# Altium schematic sheet power_supply_and_battery_management.schdoc: Power Supply
size A4; Author: John-William Lebel; DocumentNumber: 1; Revision: A; SheetNumber: 1; SheetTotal: 4
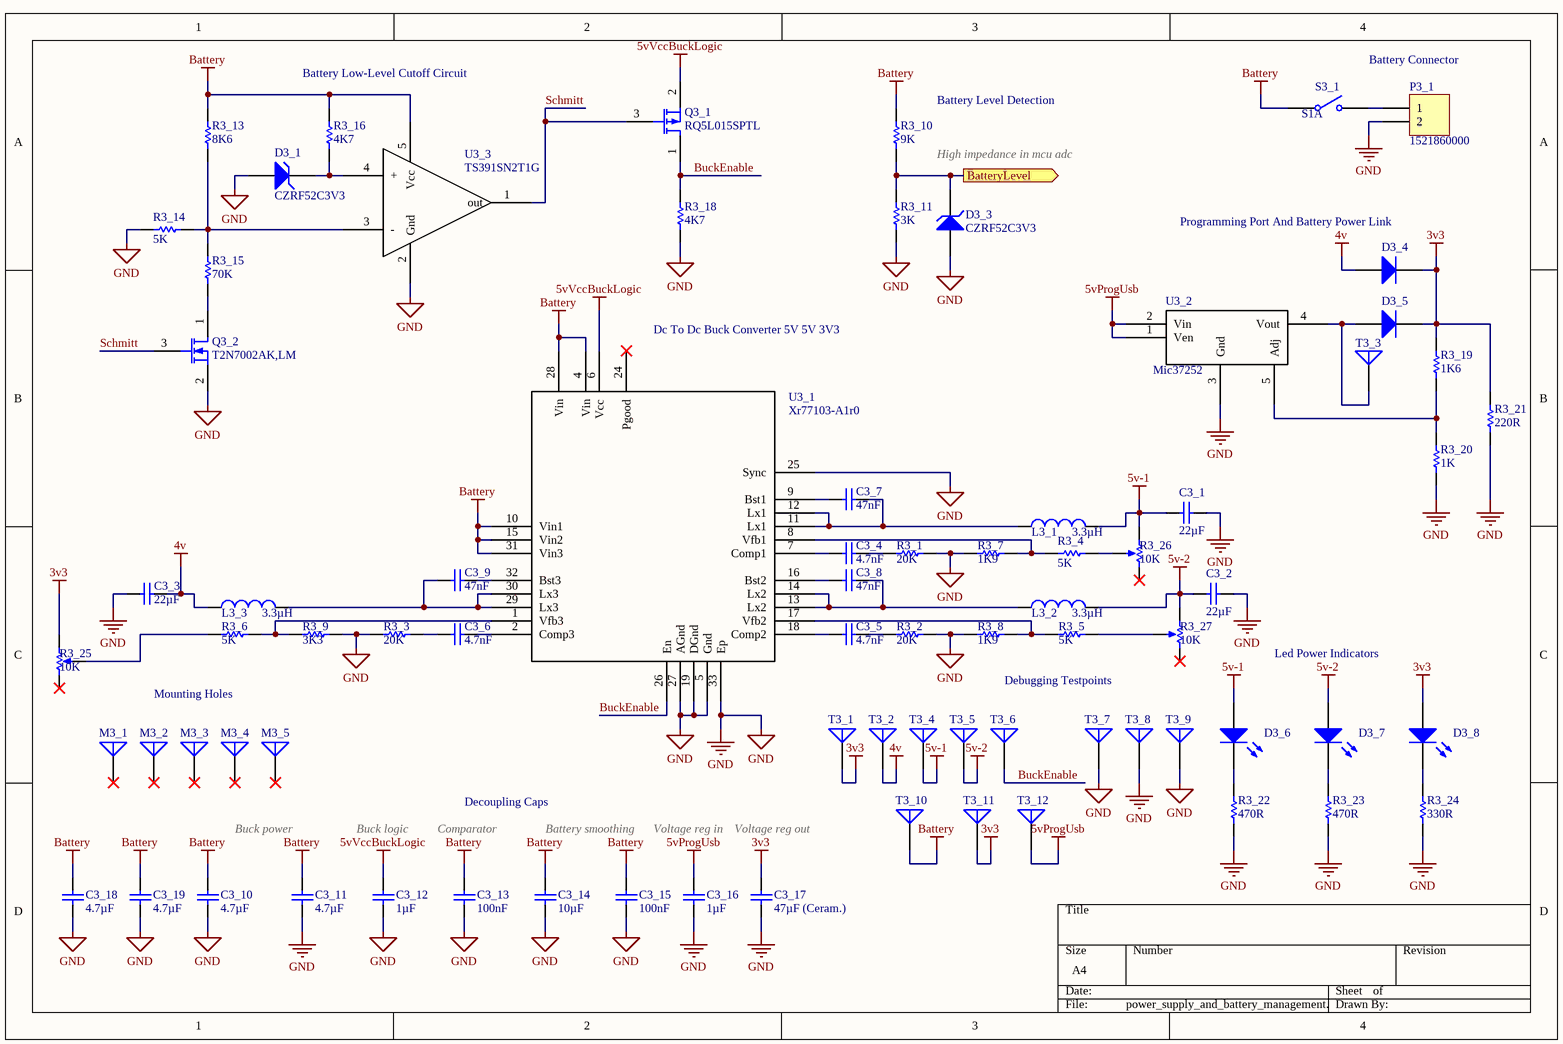
[diagram p0: power_supply_and_battery_management.schdoc]

## Parts
C3_1  value 22µF  [C1206]  (hidden comment: CL31A226KOHNNNE)
C3_2  value 22µF  [C1206]  (hidden comment: CL31A226KOHNNNE)
C3_3  value 22µF  [C1206]  (hidden comment: CL31A226KOHNNNE)
C3_4  value 4.7nF  [C1206]  (hidden comment: CML1206X7R472KT50V)
C3_5  value 4.7nF  [C1206]  (hidden comment: CML1206X7R472KT50V)
C3_6  value 4.7nF  [C1206]  (hidden comment: CML1206X7R472KT50V)
C3_7  value 47nF  [C1206]  (hidden comment: 885012208085)
C3_8  value 47nF  [C1206]  (hidden comment: 885012208085)
C3_9  value 47nF  [C1206]  (hidden comment: 885012208085)
C3_10  value 4.7µF  [C1206]  (hidden comment: CM316X5R475K25AT)
C3_11  value 4.7µF  [C1206]  (hidden comment: CM316X5R475K25AT)
C3_12  value 1µF  [C1206]  (hidden comment: 885382208005)
C3_13  value 100nF  [C1206]  (hidden comment: 12063C104MAT2A)
C3_14  value 10µF  [C1206]  (hidden comment: EMK316BJ106MLHT)
C3_15  value 100nF  [C1206]  (hidden comment: 12063C104MAT2A)
C3_16  value 1µF  [C1206]  (hidden comment: 885382208005)
C3_17  value 47µF (Ceram.)  [C1206]  (hidden comment: EMK316BBJ476ML-T)
C3_18  value 4.7µF  [C1206]  (hidden comment: CM316X5R475K25AT)
C3_19  value 4.7µF  [C1206]  (hidden comment: CM316X5R475K25AT)
D3_1  CZRF52C3V3  [C1206-POLARIZED]
D3_3  CZRF52C3V3  [C1206-POLARIZED]
D3_4  ACDBN160-HF  [C1206-POLARIZED]  (value not drawn)
D3_5  ACDBN160-HF  [C1206-POLARIZED]  (value not drawn)
D3_6  APT3216SGC  [C1206-POLARIZED]  (value not drawn)
D3_7  APT3216SGC  [C1206-POLARIZED]  (value not drawn)
D3_8  APT3216SGC  [C1206-POLARIZED]  (value not drawn)
L3_1  value 3.3µH  [mpxv1D0830]  (hidden comment: MPXV1D0830L3R3)
L3_2  value 3.3µH  [mpxv1D0830]  (hidden comment: MPXV1D0830L3R3)
L3_3  value 3.3µH  [mpxv1D0830]  (hidden comment: MPXV1D0830L3R3)
M3_1  Mounting Hole  [MOUNTING-HOLE-M3]  (value not drawn)
M3_2  Mounting Hole  [MOUNTING-HOLE-M3]  (value not drawn)
M3_3  Mounting Hole  [MOUNTING-HOLE-M3]  (value not drawn)
M3_4  Mounting Hole  [MOUNTING-HOLE-M3]  (value not drawn)
M3_5  Mounting Hole  [MOUNTING-HOLE-M3]  (value not drawn)
P3_1  1521860000  [HDR1X2-508-POLARIZED]
Q3_1  RQ5L015SPTL  [SOT23_L]
Q3_2  T2N7002AK,LM  [SOT23_L]
R3_1  value 20K  [C1206]  (hidden comment: Res1)
R3_2  value 20K  [C1206]  (hidden comment: Res1)
R3_3  value 20K  [C1206]  (hidden comment: Res1)
R3_4  value 5K  [C1206]  (hidden comment: Res1)
R3_5  value 5K  [C1206]  (hidden comment: Res1)
R3_6  value 5K  [C1206]  (hidden comment: Res1)
R3_7  value 1K9  [C1206]  (hidden comment: Res1)
R3_8  value 1K9  [C1206]  (hidden comment: Res1)
R3_9  value 3K3  [C1206]  (hidden comment: Res1)
R3_10  value 9K  [C1206]  (hidden comment: Res1)
R3_11  value 3K  [C1206]  (hidden comment: Res1)
R3_13  value 8K6  [C1206]  (hidden comment: Res1)
R3_14  value 5K  [C1206]  (hidden comment: Res1)
R3_15  value 70K  [C1206]  (hidden comment: Res1)
R3_16  value 4K7  [C1206]  (hidden comment: Res1)
R3_18  value 4K7  [C1206]  (hidden comment: Res1)
R3_19  value 1K6  [C1206]  (hidden comment: Res1)
R3_20  value 1K  [C1206]  (hidden comment: Res1)
R3_21  value 220R  [C1206]  (hidden comment: Res1)
R3_22  value 470R  [C1206]  (hidden comment: Res1)
R3_23  value 470R  [C1206]  (hidden comment: Res1)
R3_24  value 330R  [C1206]  (hidden comment: Res1)
R3_25  value 10K  [ST-4ETA103]  (hidden comment: ST4ETA103)
R3_26  value 10K  [ST-4ETA103]  (hidden comment: ST4ETA103)
R3_27  value 10K  [ST-4ETA103]  (hidden comment: ST4ETA103)
S3_1  S1A  [SW2-THR]
T3_1  Mounting Hole  [TESTPOINT]  (value not drawn)
T3_2  Mounting Hole  [TESTPOINT]  (value not drawn)
T3_3  Mounting Hole  [TESTPOINT]  (value not drawn)
T3_4  Mounting Hole  [TESTPOINT]  (value not drawn)
T3_5  Mounting Hole  [TESTPOINT]  (value not drawn)
T3_6  Mounting Hole  [TESTPOINT]  (value not drawn)
T3_7  Mounting Hole  [TESTPOINT]  (value not drawn)
T3_8  Mounting Hole  [TESTPOINT]  (value not drawn)
T3_9  Mounting Hole  [TESTPOINT]  (value not drawn)
T3_10  Mounting Hole  [TESTPOINT]  (value not drawn)
T3_11  Mounting Hole  [TESTPOINT]  (value not drawn)
T3_12  Mounting Hole  [TESTPOINT]  (value not drawn)
U3_1  Xr77103-A1r0  [32-TQFN (4x4)]
U3_2  Mic37252  [TO-263 (5)]
U3_3  TS391SN2T1G  [TSOP5(6)]

## Ports
BatteryLevel (out)

## Nets
3v3: C3_17.2 D3_4.2(K) D3_5.2(K) D3_8.1(A) R3_19.1 R3_21.1 R3_25.1(BOT) T3_1.1(A) T3_11.1(A)
4v: C3_3.2 D3_4.1(A) L3_3.1 T3_2.1(A)
5v-1: C3_1.2 D3_6.1(A) L3_1.2 R3_26.1(TOP) T3_4.1(A)
5v-2: C3_2.2 D3_7.1(A) L3_2.2 R3_27.1(TOP) T3_5.1(A)
5vProgUsb: C3_16.2 T3_12.1(A) U3_2.1(Ven) U3_2.2(Vin)
5vVccBuckLogic: C3_12.2 Q3_1.2(S) U3_1.6(Vcc)
Battery: C3_10.2 C3_11.2 C3_13.2 C3_14.2 C3_15.2 C3_18.2 C3_19.2 R3_10.2 R3_13.2 R3_16.2 S3_1.1(COMMON) T3_10.1(A) U3_1.4(Vin) U3_1.10(Vin1) U3_1.15(Vin2) U3_1.28(Vin) U3_1.31(Vin3) U3_3.5(Vcc)
GND: C3_1.1 C3_2.1 C3_3.1 C3_10.1 C3_11.1 C3_12.1 C3_13.1 C3_14.1 C3_15.1 C3_16.1 C3_17.1 C3_18.1 C3_19.1 D3_1.1(A) D3_3.1(A) P3_1.2 Q3_2.2(S) R3_1.2 R3_2.2 R3_3.1 R3_7.1 R3_8.1 R3_9.2 R3_11.1 R3_14.1 R3_18.1 R3_20.2 R3_21.2 R3_22.2 R3_23.2 R3_24.2 T3_7.1(A) T3_8.1(A) T3_9.1(A) U3_1.5(Gnd) U3_1.19(DGnd) U3_1.25(Sync) U3_1.27(AGnd) U3_1.33(Ep) U3_2.3(Gnd) U3_3.2(Gnd)
BatteryLevel: D3_3.2(K) R3_10.1 R3_11.2 ; port BatteryLevel
BuckEnable: Q3_1.1(D) R3_18.2 T3_6.1(A) U3_1.26(En)
Schmitt: Q3_1.3(G) Q3_2.3(G) U3_3.1(out)
NetC3_4_1: C3_4.1 U3_1.7(Comp1)
NetC3_4_2: C3_4.2 R3_1.1
NetC3_5_1: C3_5.1 U3_1.18(Comp2)
NetC3_5_2: C3_5.2 R3_2.1
NetC3_6_1: C3_6.1 R3_3.2
NetC3_6_2: C3_6.2 U3_1.2(Comp3)
NetC3_7_1: C3_7.1 U3_1.9(Bst1)
NetC3_7_2: C3_7.2 L3_1.1 U3_1.11(Lx1) U3_1.12(Lx1)
NetC3_8_1: C3_8.1 U3_1.16(Bst2)
NetC3_8_2: C3_8.2 L3_2.1 U3_1.13(Lx2) U3_1.14(Lx2)
NetC3_9_1: C3_9.1 L3_3.2 U3_1.29(Lx3) U3_1.30(Lx3)
NetC3_9_2: C3_9.2 U3_1.32(Bst3)
NetD3_1_2: D3_1.2(K) R3_16.1 U3_3.4(+)
NetD3_5_1: D3_5.1(A) T3_3.1(A) U3_2.4(Vout)
NetD3_6_2: D3_6.2(K) R3_22.1
NetD3_7_2: D3_7.2(K) R3_23.1
NetD3_8_2: D3_8.2(K) R3_24.1
NetP3_1_1: P3_1.1 S3_1.2(NO)
NetQ3_2_1: Q3_2.1(D) R3_15.1
NetR3_4_1: R3_4.1 R3_7.2 U3_1.8(Vfb1)
NetR3_4_2: R3_4.2 R3_26.3(TAP)
NetR3_5_1: R3_5.1 R3_8.2 U3_1.17(Vfb2)
NetR3_5_2: R3_5.2 R3_27.3(TAP)
NetR3_6_1: R3_6.1 R3_25.3(TAP)
NetR3_6_2: R3_6.2 R3_9.1 U3_1.1(Vfb3)
NetR3_13_1: R3_13.1 R3_14.2 R3_15.2 U3_3.3(-)
NetR3_19_2: R3_19.2 R3_20.1 U3_2.5(Adj)

Not connected (* = marked no-connect by the designer): M3_1 1(A)*; M3_2 1(A)*; M3_3 1(A)*; M3_4 1(A)*; M3_5 1(A)*; R3_25 2(TOP)*; R3_26 2(BOT)*; R3_27 2(BOT)*; U3_1 24(Pgood)*

## Notes on the sheet
- (near R3_16) Battery Low-Level Cutoff Circuit
- (near R3_10) Battery Level Detection
- Battery Connector
- High impedance in mcu adc
- (near D3_4) Programming Port And Battery Power Link
- Dc To Dc Buck Converter 5V 5V 3V3
- Led Power Indicators
- Mounting Holes
- Debugging Testpoints
- Buck power
- Buck logic
- Comparator
- Decoupling Caps
- Battery smoothing
- Voltage reg in
- Voltage reg out

## Library data of the parts
C3_1-C3_19 = Cap: Capacitor; Published: 8-Jun-2000; LatestRevisionDate: 17-Jul-2002; LatestRevisionNote: Re-released for DXP Platform.; PackageReference: RAD-0.3; Publisher: Altium Limited; PackageDescription: Radial Cap, Thru-Hole; 2 Leads; 0.3 in Pin Spacing
D3_1 D3_3 = D Zener: Zener Diode; Published: 8-Jun-2000; LatestRevisionDate: 17-Jul-2002; LatestRevisionNote: Re-released for DXP Platform.; PackageReference: DIODE-0.7; Publisher: Altium Limited; PackageDescription: Diode, Thru-Hole; 2 Leads; 0.7 in Pin Spacing
D3_4 D3_5 = Diode: Default Diode; Published: 8-Jun-2000; LatestRevisionDate: 17-Jul-2002; LatestRevisionNote: Re-released for DXP Platform.; PackageVersion: Sep-1996; PackageReference: SMC; Publisher: Altium Limited; PackageDescription: DO-214-AB/SMC; 2 C-Bend Leads; Body 7.9 x 5.9 mm, inc. leads (LxW); Code_JEDEC: DO-214-AB
D3_6-D3_8 = LED0: Typical INFRARED GaAs LED; Published: 8-Jun-2000; LatestRevisionDate: 08-Jul-2005; LatestRevisionNote: Mech Layer 1 removed.; PackageReference: LED-0; Publisher: Altium Limited; PackageDescription: LED; 2 Leads
L3_1-L3_3 = Inductor: Code_IEC: 1005; Published: 8-Jun-2000; LatestRevisionDate: 29-May-2009; LatestRevisionNote: IPC-7351 Footprint Added.; PackageReference: 0402-A; Publisher: Altium Limited; PackageDescription: Chip Inductor; Code_JEITA: 0402
M3_1-M3_5 T3_1-T3_12 = Antenna: Generic Antenna; Published: 24-Mar-1999; LatestRevisionDate: 17-Jul-2002; LatestRevisionNote: Re-released for DXP Platform.; PackageReference: PIN1; Publisher: Altium Limited
P3_1 = Header 2: Header, 2-Pin; LatestRevisionDate: 17-Jul-2002; LatestRevisionNote: Re-released for DXP Platform.; Publisher: Altium Limited
Q3_1 = MOSFET-P: P-Channel MOSFET; Published: 8-Jun-2000; LatestRevisionDate: 17-Jul-2002; LatestRevisionNote: Re-released for DXP Platform.; PackageVersion: 1995/1996; PackageReference: E3; Publisher: Altium Limited; PackageDescription: TO, Flat Index; 3 In-Line, Axial Leads; Body Dia. 4.6mm; Lead Dia. 0.5 mm (max)
Q3_2 = MOSFET-N: N-Channel MOSFET; Published: 8-Jun-2000; LatestRevisionDate: 17-Jul-2002; LatestRevisionNote: Re-released for DXP Platform.; PackageVersion: 1995/1996; PackageReference: E3; Publisher: Altium Limited; PackageDescription: TO, Flat Index; 3 In-Line, Axial Leads; Body Dia. 4.6mm; Lead Dia. 0.5 mm (max)
R3_1-R3_11 R3_13-R3_16 R3_18-R3_24 = Res1: Resistor; Published: 8-Jun-2000; LatestRevisionDate: 17-Jul-2002; LatestRevisionNote: Re-released for DXP Platform.; PackageReference: AXIAL-0.3; Publisher: Altium Limited; PackageDescription: Axial Device, Thru-Hole; 2 Leads; 0.3 in Pin Spacing
R3_25-R3_27 = RPot: Potentiometer; Sim Note: Enter the Resistance value and the set point into parameter fields.; Set Position: 0.5; Published: 8-Jun-2000; LatestRevisionDate: 17-Jul-2002; LatestRevisionNote: Re-released for DXP Platform.; PackageReference: VR5; Publisher: Altium Limited; PackageDescription: Variable Resistor, Thru-Hole; 3 Leads
S3_1 = SW-SPST: Single-Pole, Single-Throw Switch; Published: 24-Mar-1999; LatestRevisionDate: 17-Jul-2002; LatestRevisionNote: Re-released for DXP Platform.; PackageReference: SPST-2; Publisher: Altium Limited; PackageDescription: Switch; 2 Leads
U3_1 = Xr77103-A1r0: Dc to dc step down converter
U3_3 = Op Amp